# Altium schematic sheet ant_system.SchDoc
size A4; Revision: A
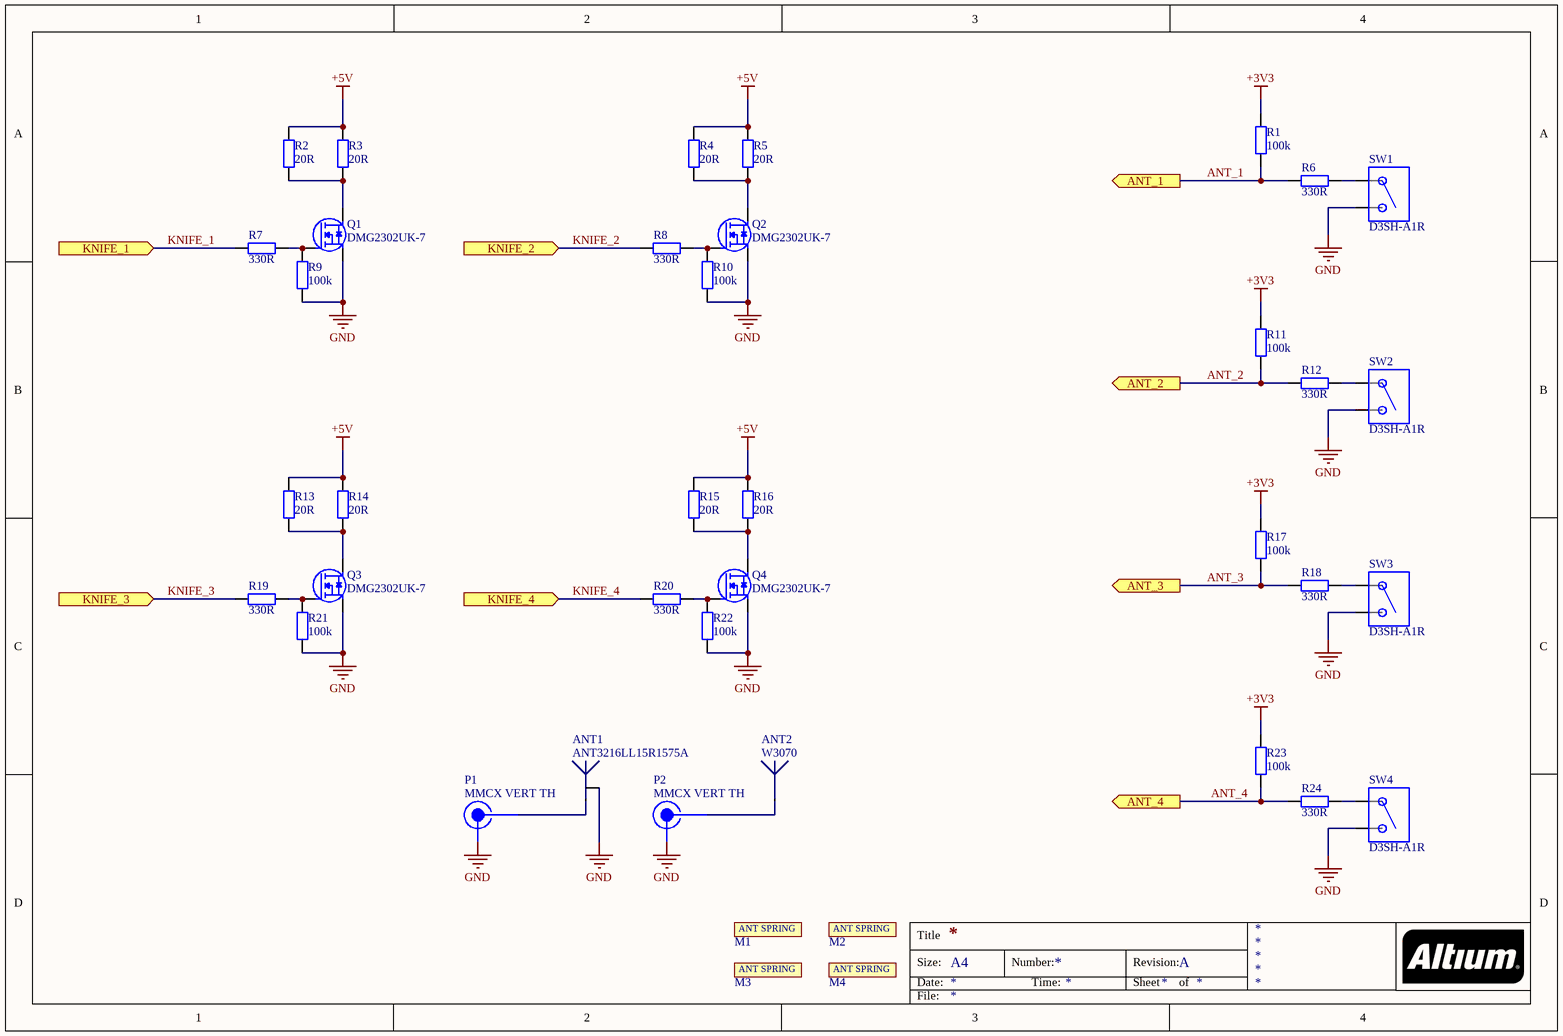
[diagram p0: ant_system.SchDoc]

## Parts
ANT1  ANT3216LL15R1575A  [ANT3216LL15]
ANT2  W3070  [W3070]
M1  *  [ANT_SPRING]  (value not drawn)  (no BOM)
M2  *  [ANT_SPRING]  (value not drawn)  (no BOM)
M3  *  [ANT_SPRING]  (value not drawn)  (no BOM)
M4  *  [ANT_SPRING]  (value not drawn)  (no BOM)
P1  MMCX VERT TH  [MMCX_VERT_TH]
P2  MMCX VERT TH  [MMCX_VERT_TH]
Q1  DMG2302UK-7  [SOT23]
Q2  DMG2302UK-7  [SOT23]
Q3  DMG2302UK-7  [SOT23]
Q4  DMG2302UK-7  [SOT23]
R1  100k  [R0603_IPC_MD]
R2  20R  [R0805_IPC_MD]
R3  20R  [R0805_IPC_MD]
R4  20R  [R0805_IPC_MD]
R5  20R  [R0805_IPC_MD]
R6  330R  [R0603_IPC_MD]
R7  330R  [R0603_IPC_MD]
R8  330R  [R0603_IPC_MD]
R9  100k  [R0603_IPC_MD]
R10  100k  [R0603_IPC_MD]
R11  100k  [R0603_IPC_MD]
R12  330R  [R0603_IPC_MD]
R13  20R  [R0805_IPC_MD]
R14  20R  [R0805_IPC_MD]
R15  20R  [R0805_IPC_MD]
R16  20R  [R0805_IPC_MD]
R17  100k  [R0603_IPC_MD]
R18  330R  [R0603_IPC_MD]
R19  330R  [R0603_IPC_MD]
R20  330R  [R0603_IPC_MD]
R21  100k  [R0603_IPC_MD]
R22  100k  [R0603_IPC_MD]
R23  100k  [R0603_IPC_MD]
R24  330R  [R0603_IPC_MD]
SW1  D3SH-A1R  [D3SH-A1R]
SW2  D3SH-A1R  [D3SH-A1R]
SW3  D3SH-A1R  [D3SH-A1R]
SW4  D3SH-A1R  [D3SH-A1R]

## Ports
ANT_1 (out), ANT_2 (out), ANT_3 (out), ANT_4 (out), KNIFE_1 (in), KNIFE_2 (in), KNIFE_3 (in), KNIFE_4 (in)

## Nets
+3V3: R1.2 R11.2 R17.2 R23.2
+5V: R2.2 R3.2 R4.2 R5.2 R13.2 R14.2 R15.2 R16.2
GND: ANT1.2 P1.1 P2.1 Q1.2(S) Q2.2(S) Q3.2(S) Q4.2(S) R9.1 R10.1 R21.1 R22.1 SW1.2 SW2.2 SW3.2 SW4.2
ANT_1: R1.1 R6.2 ; port ANT_1
ANT_2: R11.1 R12.2 ; port ANT_2
ANT_3: R17.1 R18.2 ; port ANT_3
ANT_4: R23.1 R24.2 ; port ANT_4
KNIFE_1: R7.2 ; port KNIFE_1
KNIFE_2: R8.2 ; port KNIFE_2
KNIFE_3: R19.2 ; port KNIFE_3
KNIFE_4: R20.2 ; port KNIFE_4
NetANT1_1: ANT1.1 P1.2
NetANT2_1: ANT2.1 P2.2
NetQ1_1: Q1.1(G) R7.1 R9.2
NetQ1_3: Q1.3(D) R2.1 R3.1
NetQ2_1: Q2.1(G) R8.1 R10.2
NetQ2_3: Q2.3(D) R4.1 R5.1
NetQ3_1: Q3.1(G) R19.1 R21.2
NetQ3_3: Q3.3(D) R13.1 R14.1
NetQ4_1: Q4.1(G) R20.1 R22.2
NetQ4_3: Q4.3(D) R15.1 R16.1
NetR6_1: R6.1 SW1.1
NetR12_1: R12.1 SW2.1
NetR18_1: R18.1 SW3.1
NetR24_1: R24.1 SW4.1

## Notes on the sheet
- Title
- Size:
- Date:
- A4
- Number:
- Time:
- Revision:
- Sheet
- of
- File:
- (in symbol ANT_SPRING) ANT SPRING

## Library data of the parts
ANT1 = ANT3216LL15R1575A: RF ANT 1.575GHZ CHIP SOLDER SMD; Manufacturer: Yageo; Manufacturer Part Number: ANT3216LL15R1575A; Supplier 1: Digi-Key; Supplier Part Number 1: 311-1543-1-ND
ANT2 = W3070: RF ANT 900MHZ/1.8GHZ CHIP SLD; Manufacturer: PulseLarsen Antennas; Manufacturer Part Number: W3070; Supplier 1: Digi-Key; Supplier Part Number 1: 553-1695-1-ND
M1-M4 = ANT_SPRING: Antenna spring soldering pad; Manufacturer: *; Manufacturer Part Number: *; Supplier 1: *; Supplier Part Number 1: *; Link: *
P1 P2 = MMCX_VERT: MMCX PCB TH VERT CONN; Manufacturer: China; Manufacturer Part Number: MMCX VERT TH; Supplier 1: Aliexpress; Supplier Part Number 1: MMCX VERT TH
Q1-Q4 = DMG2302: N-Channel Logic Level Enhancement Mode Field Effect Transistor; Manufacturer: Diodes Incorporated; Manufacturer Part Number: DMG2302UK-7; Supplier 1: Digi-Key; Supplier Part Number 1: DMG2302UK-7DICT-ND
R1 R9-R11 R17 R21-R23 = RMCF0603FT100K: RES 100K OHM 1% 1/10W 0603; Manufacturer: Bourns Inc.; Value: 100k; Tolarance: 1%; Manufacturer Part Number: RMCF0603FT100K; Supplier 1: Digi-Key; Supplier Part Number 1: RMCF0603FT100KCT-ND
R2-R5 R13-R16 = RC0805JR-0720RL: RES SMD 20 OHM 5% 1/8W 0805; Manufacturer: Yageo; Value: 20R; Tolarance: 5%; Manufacturer Part Number: RC0805JR-0720RL; Supplier 1: Digi-Key; Supplier Part Number 1: 311-20ARDKR-ND
R6-R8 R12 R18-R20 R24 = CR0603-JW-331ELF: RES SMD 330 OHM 5% 1/10W 0603; Manufacturer: Bourns Inc.; Value: 330R; Tolarance: 5%; Manufacturer Part Number: CR0603-JW-331ELF; Supplier 1: Digi-Key; Supplier Part Number 1: CR0603-JW-331ELFCT-ND
SW1-SW4 = D3SH-A1R: SWITCH DETECTOR SPST-NO 1MA 5V; Manufacturer: Omron Electronics Inc-EMC Div; Manufacturer Part Number: D3SH-A1R; Supplier 1: Digi-Key; Supplier Part Number 1: SW1043CT-ND